# Altium schematic sheet interfaceUART&I2C.SchDoc
size A; SheetNumber: 3; SheetTotal: 9
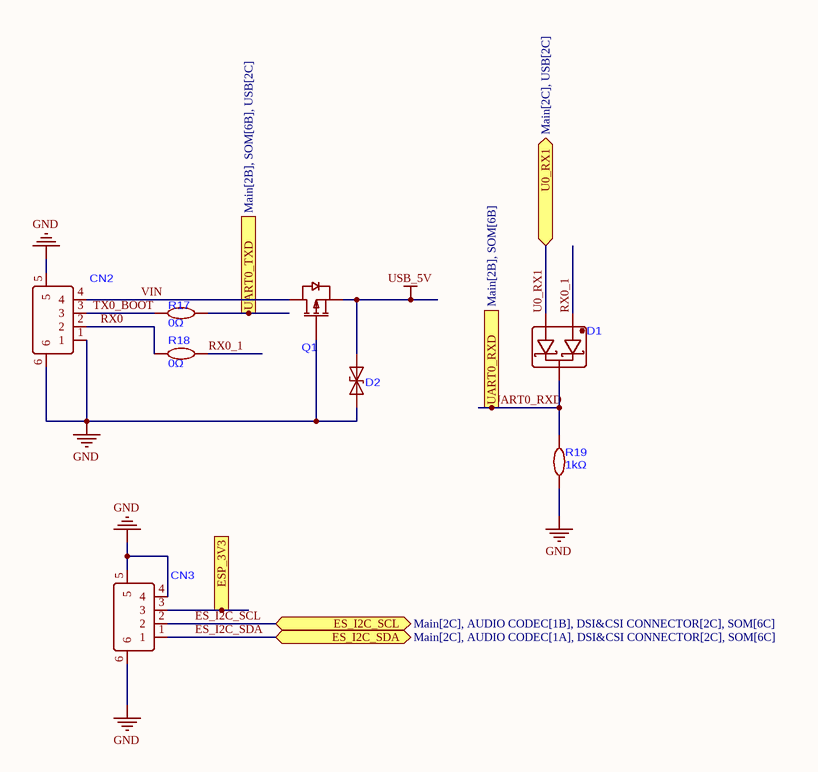
[diagram p0: interfaceUART&I2C.SchDoc]

## Parts
CN2  533980471  [CONN-SMD_4P-P1.25_XUNPU_WAFER-GH1.25-4PWB]  (value not drawn)
CN3  533980471  [CONN-SMD_4P-P1.25_XUNPU_WAFER-GH1.25-4PWB]  (value not drawn)
D1  DIODE ARR SCHOTTKY 30V SOT-23  [SOT-23-3_L2.9-W1.3-P1.90-LS2.4-BR]  (value not drawn)
D2  TVS DIODE 5VWM 18.6VC SOD-523  [SOD-523_L1.2-W0.8-LS1.6-BI]  (value not drawn)
Q1  MOSFET P-CH 30V 4.3A SOT-23  [2SOT-23-3_L2.9-W1.6-P1.90-LS2.8-BR]  (value not drawn)
R17  0Ω  [R0603]
R18  0Ω  [R0603]
R19  1kΩ  [R0603]

## Ports
ES_I2C_SCL (bidir, see Main[2C], AUDIO CODEC[1B], DSI&CSI CONNECTOR[2C], SOM[6C]), ES_I2C_SDA (bidir, see Main[2C], AUDIO CODEC[1A], DSI&CSI CONNECTOR[2C], SOM[6C]), ESP_3V3 (in, see Main[2C], DSI&CSI CONNECTOR[3C], ETH-PHY[2A], Power[3C], SOM[6B]), U0_RX1 (bidir, see Main[2C], USB[2C]), UART0_RXD (out, see Main[2B], SOM[6B]), UART0_TXD (in, see Main[2B], SOM[6B], USB[2C])

## Nets
GND: CN2.1 CN2.5 CN2.6 CN3.4 CN3.5 CN3.6 D2.1(K) Q1.1(G) R19.1
USB_5V: D2.2(A) Q1.2(S)
ES_I2C_SCL: CN3.2 ; port ES_I2C_SCL
ES_I2C_SDA: CN3.1 ; port ES_I2C_SDA
ESP_3V3: CN3.3 ; port ESP_3V3
RX0: CN2.2 R18.1
RX0_1: D1.1 R18.2
TX0_BOOT: CN2.3 R17.1
U0_RX1: D1.2 ; port U0_RX1
UART0_RXD: D1.3 R19.2 ; port UART0_RXD
UART0_TXD: R17.2 ; port UART0_TXD
VIN: CN2.4 Q1.3(D)

## Library data of the parts
CN2 CN3 = 533980471: 4P PicoBlade(MX 1.25) 1x4P Tin -40℃~+105℃ White 1.25mm 125V 4 1A 1 Surface Mount,Vertical SMD,P=1.25mm Headers, Male Pins RoHS
D1 = BAT54C_C916424: 600mA 30V 1 Pair Common Cathode 1V@100mA 200mA SOT-23 Single Diodes RoHS
D2 = LESD5D5.0CT1G: 9.4A@8/20us 18.6V 7.8V 5V SOD-523 TVS Diodes RoHS
Q1 = AO3407A: 30V 4.3A 48mΩ@10V 2.5V@250uA 1 P-Channel SOT-23 Single FETs, MOSFETs ROHS
R17 R18 = RC0603JR-070RL: 100mW 0Ω 75V Thick Film Resistor ±5% 0603 Chip Resistor - Surface Mount RoHS
R19 = RMC 0603 1K J N: 100mW 1kΩ 50V ±100ppm/℃ Thick Film Resistor ±5% 0603 Chip Resistor - Surface Mount ROHS